# Altium schematic sheet 电子脚铐便携式主控板.SchDoc
size A4
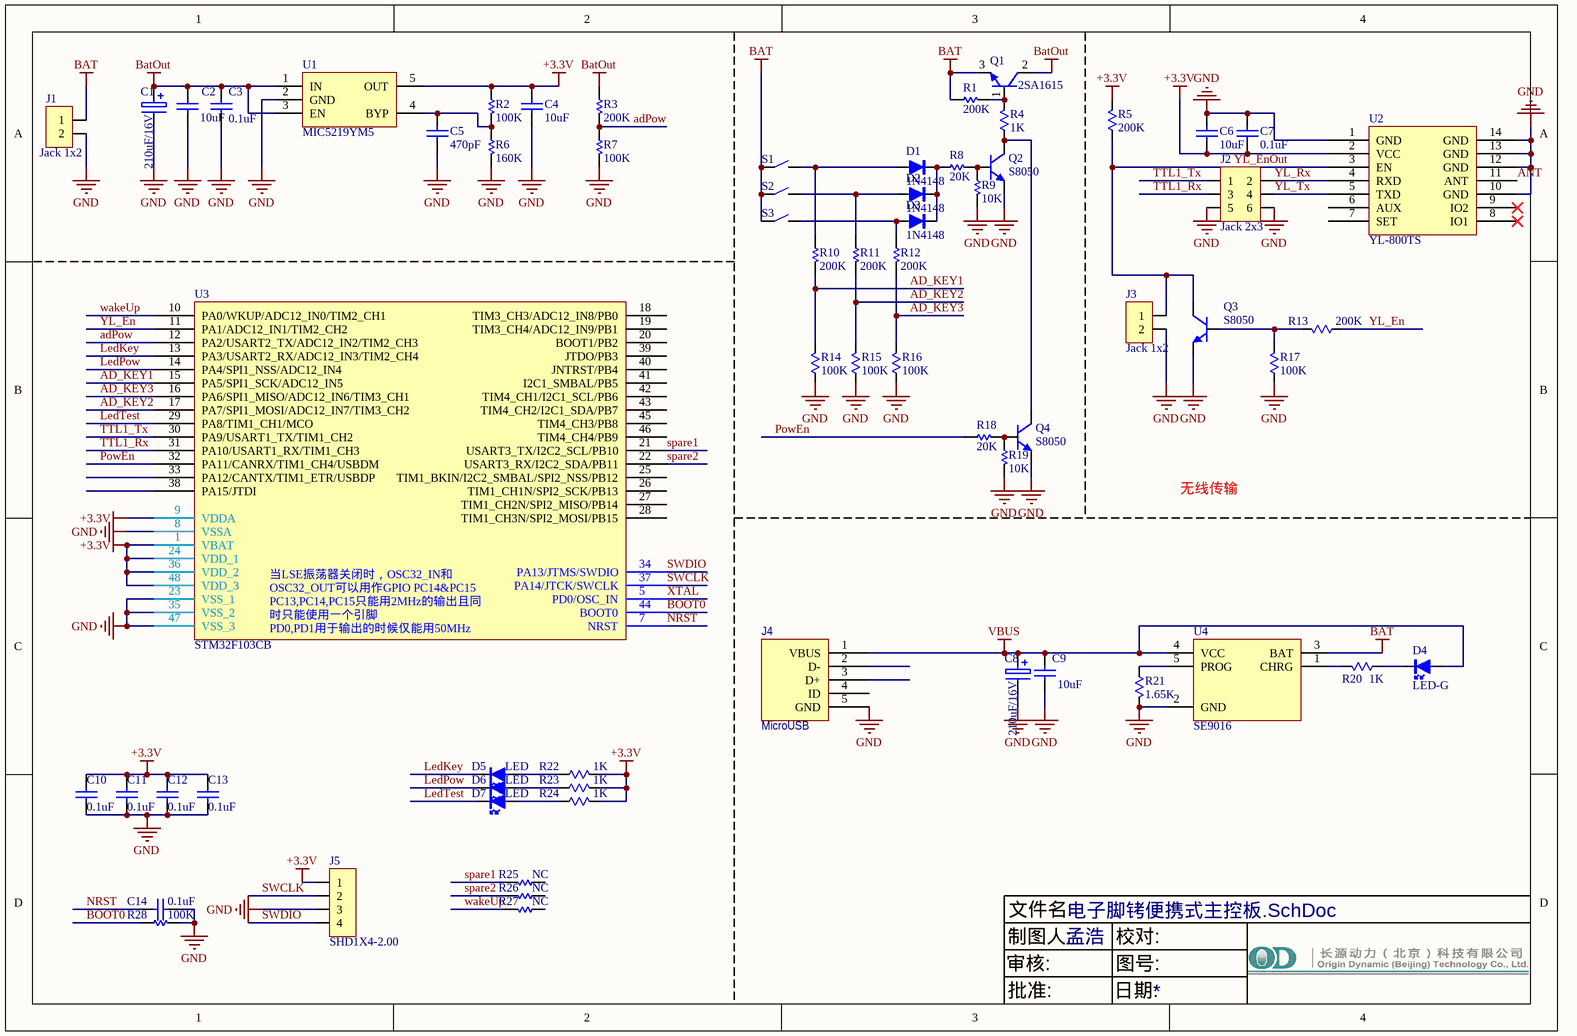
[diagram p0: 电子脚铐便携式主控板.SchDoc]

## Parts
C1  210uF/16V  [C7343]
C2  10uF  [C0603]
C3  0.1uF  [C0603]
C4  10uF  [C0603]
C5  470pF  [C0603]
C6  10uF  [C0603]
C7  0.1uF  [C0603]
C8  210uF/16V  [C7343]
C9  value 10uF  [C0603]  (hidden comment: Cap)
C10  0.1uF  [C0603]
C11  0.1uF  [C0603]
C12  0.1uF  [C0603]
C13  0.1uF  [C0603]
C14  0.1uF  [C0603]
D1  1N4148  [SOD-80-S]
D2  1N4148  [SOD-80-S]
D3  1N4148  [SOD-80-S]
D4  LED-G  [LED0805]
D5  LED  [LED0805]
D6  LED  [LED0805]
D7  LED  [LED0805]
J1  Jack 1x2  [DF13-2P-1.25V]
J2  Jack 2x3  [Jk2*3-2.0]
J3  Jack 1x2  [A6S-1101-PH]
J4  MicroUSB  [MICRO-USB]
J5  SHD1X4-2.00  [Jk1*4-2.0]
Q1  2SA1615  [TO-252]
Q2  S8050  [SOT-23]
Q3  S8050  [SOT-23]
Q4  S8050  [SOT-23]
R1  200K  [R0603]
R2  100K  [R0603]
R3  200K  [R0603]
R4  1K  [R0603]
R5  200K  [R0603]
R6  160K  [R0603]
R7  100K  [R0603]
R8  20K  [R0603]
R9  10K  [R0603]
R10  200K  [R0603]
R11  200K  [R0603]
R12  200K  [R0603]
R13  200K  [R0603]
R14  100K  [R0603]
R15  100K  [R0603]
R16  100K  [R0603]
R17  100K  [R0603]
R18  20K  [R0603]
R19  10K  [R0603]
R20  1K  [R0603]
R21  1.65K  [R0603]
R22  1K  [R0603]
R23  1K  [R0603]
R24  1K  [R0603]
R25  NC  [R0603]
R26  NC  [R0603]
R27  NC  [R0603]
R28  100K  [R0603]
S1  Switch  [B3F-4055]  (value not drawn)
S2  Switch  [B3F-4055]  (value not drawn)
S3  Switch  [B3F-4055]  (value not drawn)
U1  MIC5219YM5  [SOT-23-5]
U2  YL-800TS  [YL-800TS]
U3  STM32F103CB  [LQFP48]
U4  SE9016  [SOT-23-5]

## Nets
+3.3V: C4.1 C6.1 C7.1 C10.1 C11.1 C12.1 C13.1 J5.1 R2.1 R5.2 R22.1 R23.1 R24.1 U1.5(OUT) U2.2(VCC) U3.1(VBAT) U3.9(VDDA) U3.24(VDD_1) U3.36(VDD_2) U3.48(VDD_3)
BAT: J1.1 Q1.3(E) R1.1 S1.1 S2.1 S3.1 U4.3(BAT)
BatOut: C1.1 C2.1 C3.2 Q1.2(C) R3.1 U1.1(IN) U1.3(EN)
GND: C1.2 C2.2 C3.1 C4.2 C5.2 C6.2 C7.2 C8.2 C9.2 C10.2 C11.2 C12.2 C13.2 C14.2 J1.2 J2.5 J2.6 J3.2 J4.5(GND) J5.3 Q2.2(e) Q3.2(e) Q4.2(e) R6.2 R7.2 R9.2 R14.1 R15.1 R16.1 R17.1 R19.2 R21.1 R28.2 U1.2(GND) U2.1(GND) U2.10(GND) U2.12(GND) U2.13(GND) U2.14(GND) U3.8(VSSA) U3.23(VSS_1) U3.35(VSS_2) U3.47(VSS_3) U4.2(GND)
VBUS: C8.1 C9.1 D4.1(A) J4.1(VBUS) U4.4(VCC)
AD_KEY1: R10.2 R14.2 U3.15(PA5/SPI1_SCK/ADC12_IN5)
AD_KEY2: R11.2 R15.2 U3.17(PA7/SPI1_MOSI/ADC12_IN7/TIM3_CH2)
AD_KEY3: R12.2 R16.2 U3.16(PA6/SPI1_MISO/ADC12_IN6/TIM3_CH1)
adPow: R3.2 R7.1 U3.12(PA2/USART2_TX/ADC12_IN2/TIM2_CH3)
ANT: U2.11(ANT)
BOOT0: R28.1 U3.44(BOOT0)
LedKey: D5.2(K) U3.13(PA3/USART2_RX/ADC12_IN3/TIM2_CH4)
LedPow: D6.2(K) U3.14(PA4/SPI1_NSS/ADC12_IN4)
LedTest: D7.2(K) U3.29(PA8/TIM1_CH1/MCO)
NRST: C14.1 U3.7(NRST)
PowEn: R18.1 U3.32(PA11/CANRX/TIM1_CH4/USBDM)
spare1: R25.2 U3.21(USART3_TX/I2C2_SCL/PB10)
spare2: R26.2 U3.22(USART3_RX/I2C2_SDA/PB11)
SWCLK: J5.2 U3.37(PA14/JTCK/SWCLK)
SWDIO: J5.4 U3.34(PA13/JTMS/SWDIO)
TTL1_Rx: J2.3 U3.31(PA10/USART1_RX/TIM1_CH3)
TTL1_Tx: J2.1 U3.30(PA9/USART1_TX/TIM1_CH2)
wakeUp: R27.2 U3.10(PA0/WKUP/ADC12_IN0/TIM2_CH1)
XTAL: U3.5(PD0/OSC_IN)
YL_En: R13.1 U3.11(PA1/ADC12_IN1/TIM2_CH2)
YL_EnOut: J3.1 Q3.3(c) R5.1 U2.3(EN)
YL_Rx: J2.2 U2.4(RXD)
YL_Tx: J2.4 U2.5(TXD)
NetC5_1: C5.1 R2.2 R6.1 U1.4(BYP)
NetD1_1: D1.1(A) R10.1 S1.2
NetD1_2: D1.2(K) D2.2(K) D3.2(K) R8.1
NetD2_1: D2.1(A) R11.1 S2.2
NetD3_1: D3.1(A) R12.1 S3.2
NetD4_2: D4.2(K) R20.2
NetD5_1: D5.1(A) R22.2
NetD6_1: D6.1(A) R23.2
NetD7_1: D7.1(A) R24.2
NetQ1_1: Q1.1(B) R1.2 R4.2
NetQ2_1: Q2.1(b) R8.2 R9.1
NetQ2_3: Q2.3(c) Q4.3(c) R4.1
NetQ3_1: Q3.1(b) R13.2 R17.2
NetQ4_1: Q4.1(b) R18.2 R19.1
NetR20_1: R20.1 U4.1(CHRG)
NetR21_2: R21.2 U4.5(PROG)

Not connected (* = marked no-connect by the designer): J4 2(D-) 3(D+) 4(ID); R25 1; R26 1; R27 1; U2 6(AUX) 7(SET) 8(IO1)* 9(IO2)*; U3 2(PC13-TAMPER-RTC) 3(PC14-OSC32_IN) 4(PC15-OSC32_OUT) 6(PD1/OSC_OUT) 18(TIM3_CH3/ADC12_IN8/PB0) 19(TIM3_CH4/ADC12_IN9/PB1) 20(BOOT1/PB2) 25(TIM1_BKIN/I2C2_SMBAL/SPI2_NSS/PB12) 26(TIM1_CH1N/SPI2_SCK/PB13) 27(TIM1_CH2N/SPI2_MISO/PB14) 28(TIM1_CH3N/SPI2_MOSI/PB15) 33(PA12/CANTX/TIM1_ETR/USBDP) 38(PA15/JTDI) 39(JTDO/PB3) 40(JNTRST/PB4) 41(I2C1_SMBAL/PB5) 42(TIM4_CH1/I2C1_SCL/PB6) 43(TIM4_CH2/I2C1_SDA/PB7) 45(TIM4_CH3/PB8) 46(TIM4_CH4/PB9)

## Notes on the sheet
- 无线传输
- 文件名:
- 审核:
- 制图人:
- 孟浩
- 校对:
- 图号:
- 批准:
- 日期:
- (in symbol STM32F103Cx) OSC32_IN和OSC32_OUT可以用作通用IO PC14和PC15; PC13,PC14,PC15只能用于2MHz的输出模式且同时只能使用一个引脚; 当LSE振荡器关闭时，OSC32_IN和OSC32_OUT可以用作GPIO PC14&PC15 / PC13,PC14,PC15只能用2MHz的输出且同时只能使用一个引脚 / PD0,PD1用于输出的时候仅能用50MHz

## Library data of the parts
C1 C8 = Cap Poll
C2 C4-C7 = CAP: Published: 8-Jun-2000; LatestRevisionDate: 17-Jul-2002; LatestRevisionNote: Re-released for DXP Platform.; PackageReference: RAD-0.3; Publisher: Altium Limited
  C2 C4 C6: Value: 10uF
  C5: Value: 470pF
  C7: Value: 0.1uF
C3 C10-C14 = Cap Semi
C9 = Cap: Capacitor; Published: 8-Jun-2000; LatestRevisionDate: 17-Jul-2002; LatestRevisionNote: Re-released for DXP Platform.; PackageReference: RAD-0.3; Publisher: Altium Limited; PackageDescription: Radial Cap, Thru-Hole; 2 Leads; 0.3 in Pin Spacing
D1-D3 = DIODE-SWITCHING: Silicon Epitaxial Planar Diodes
D4 = LED
J1 J3 = Jack 1x2: 插座
J2 = Jack 2x3: 双排座
J5 = HEADER1X4
Q1 = MJD122
Q2-Q4 = S8050: NPN triode, 0.5A Max
R1-R3 R6-R12 R18 R19 R25-R28 = Res
R4 R5 R13-R17 = RES: Resistor; Published: 8-Jun-2000; LatestRevisionDate: 17-Jul-2002; LatestRevisionNote: Re-released for DXP Platform.; PackageReference: AXIAL-0.3; Publisher: Altium Limited
  R4: Value: 1K
  R5 R13: Value: 200K
  R14-R17: Value: 100K
R20-R24 = Res: Resistor; Published: 8-Jun-2000; LatestRevisionDate: 04-Mar-2005; LatestRevisionNote: PCB Footprint replaced.; PackageReference: J1-0603; Publisher: Altium Limited
  R20 R22-R24: Value: 1K
  R21: Value: 1.65K
S1-S3 = Sw
U1 = MIC5205
U3 = STM32F103Cx